# EAGLE design pinheader_breakout (EAGLE 7.4.0)
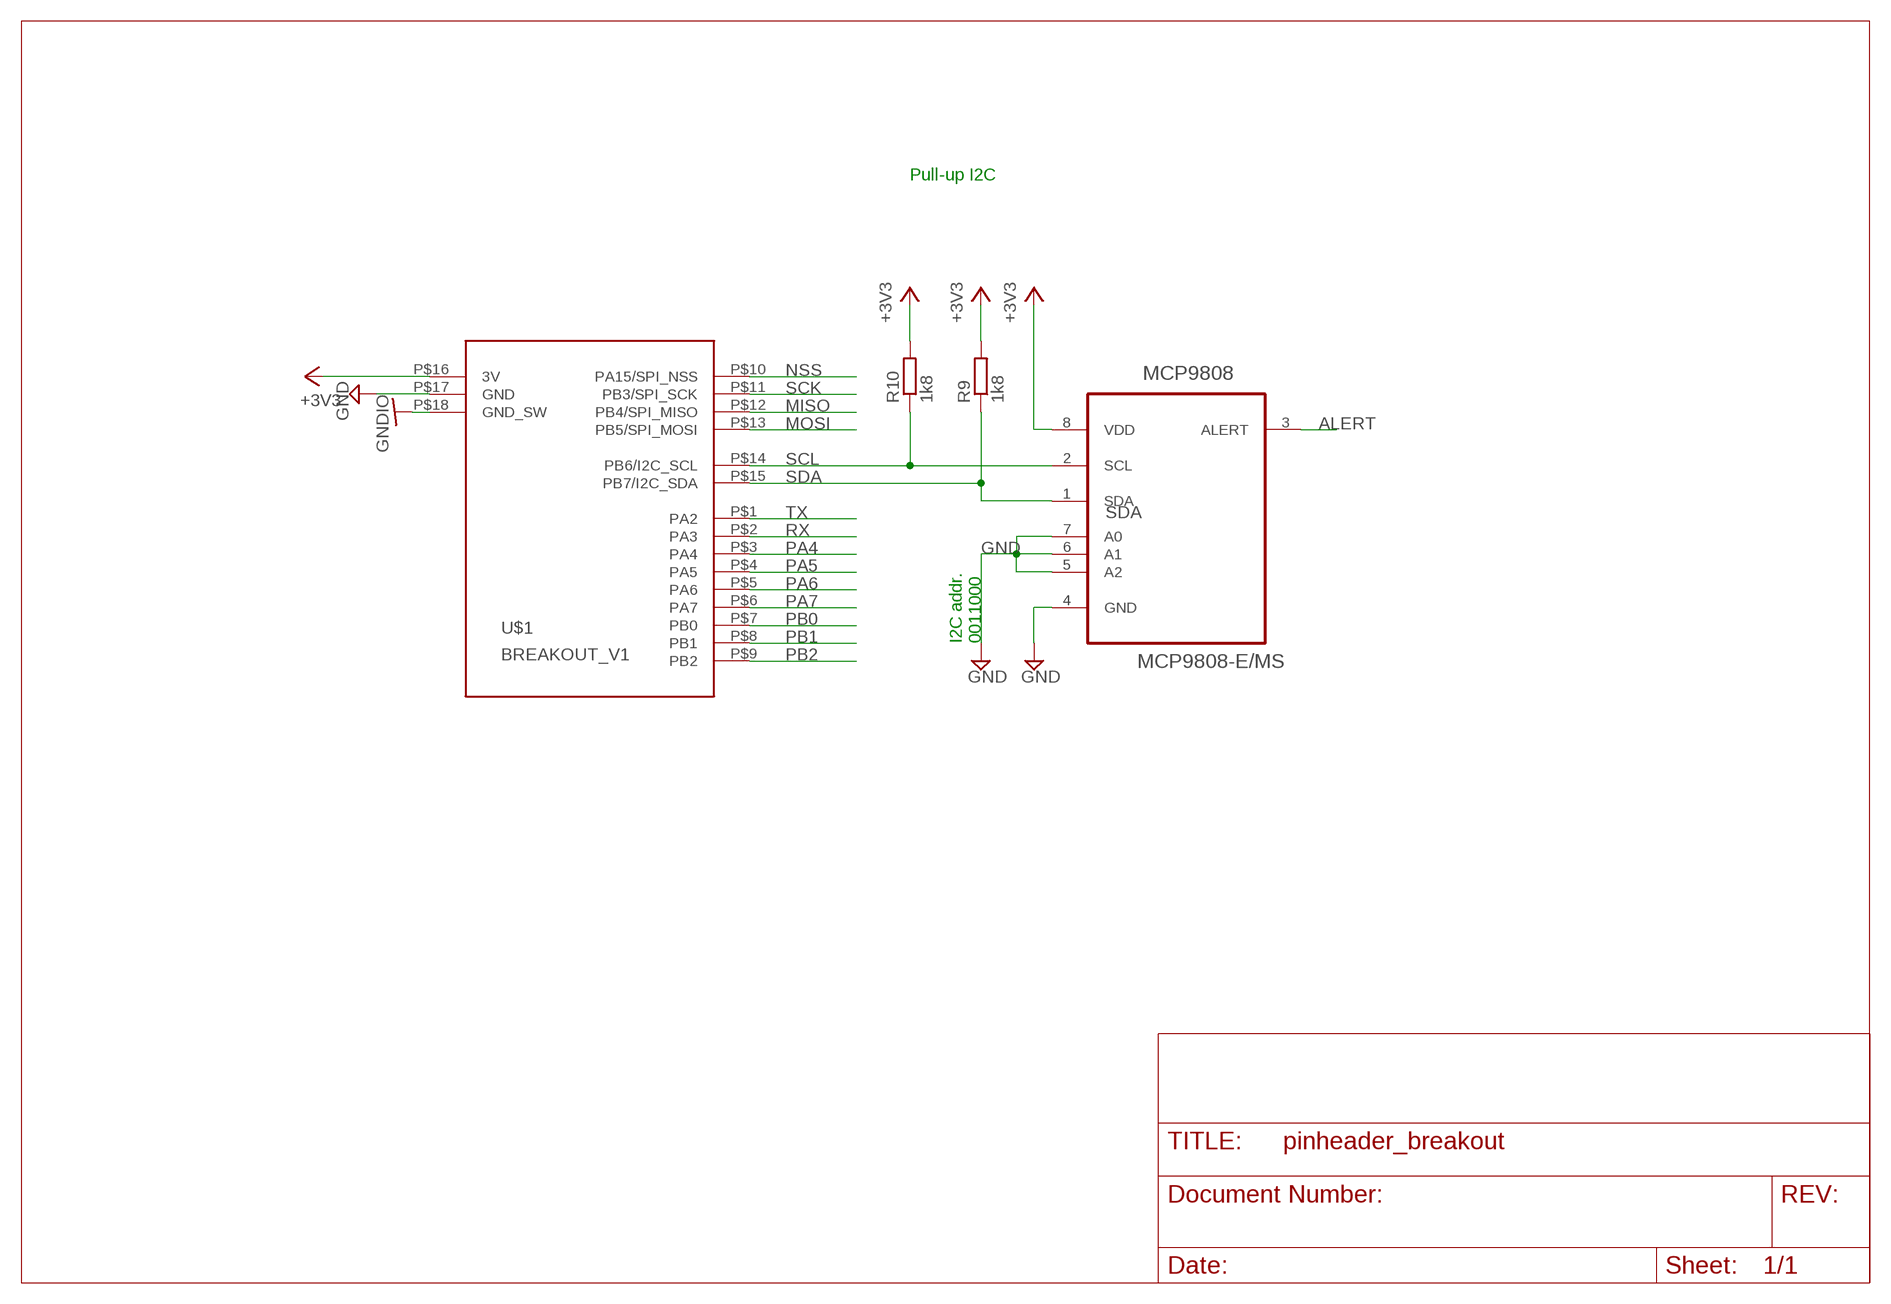
[diagram p0: schematic, sheet 1]

## Parts
MCP9808  MCP9808-E/MS  [SOP65P490X110-8N]
R9  1k8  R-EU_R0805  [R0805]
R10  1k8  R-EU_R0805  [R0805]
U$1  BREAKOUT_V1  [BREAKOUT_V1]

## Nets
+3V3: MCP9808.8(VDD) R9.2 R10.2 U$1.P$16(3V)
ALERT: MCP9808.3(ALERT)
GND: MCP9808.4(GND) MCP9808.5(A2) MCP9808.6(A1) MCP9808.7(A0) U$1.P$17(GND)
GNDIO: U$1.P$18(GND_SW)
MISO: U$1.P$12(PB4/SPI_MISO)
MOSI: U$1.P$13(PB5/SPI_MOSI)
NSS: U$1.P$10(PA15/SPI_NSS)
PA4: U$1.P$3(PA4)
PA5: U$1.P$4(PA5)
PA6: U$1.P$5(PA6)
PA7: U$1.P$6(PA7)
PB0: U$1.P$7(PB0)
PB1: U$1.P$8(PB1)
PB2: U$1.P$9(PB2)
RX: U$1.P$2(PA3)
SCK: U$1.P$11(PB3/SPI_SCK)
SCL: MCP9808.2(SCL) R10.1 U$1.P$14(PB6/I2C_SCL)
SDA: MCP9808.1(SDA) R9.1 U$1.P$15(PB7/I2C_SDA)
TX: U$1.P$1(PA2)

## Notes on the sheet
- Pull-up I2C
- I2C addr. 
  0011000

## Library data of the parts
MCP9808 = mcp9808:MCP9808-E/MS: Digital Temperature Sensor,MSOP-8; MPN: MCP9808-E/MS; OC_FARNELL: 2080523; OC_NEWARK: 89T8871; PACKAGE: MSOP-8; SUPPLIER: MICROCHIP
R9 R10 = rcl:R-EU_: RESISTOR, European symbol
U$1 = breakout_base:BREAKOUT_V1

## Board
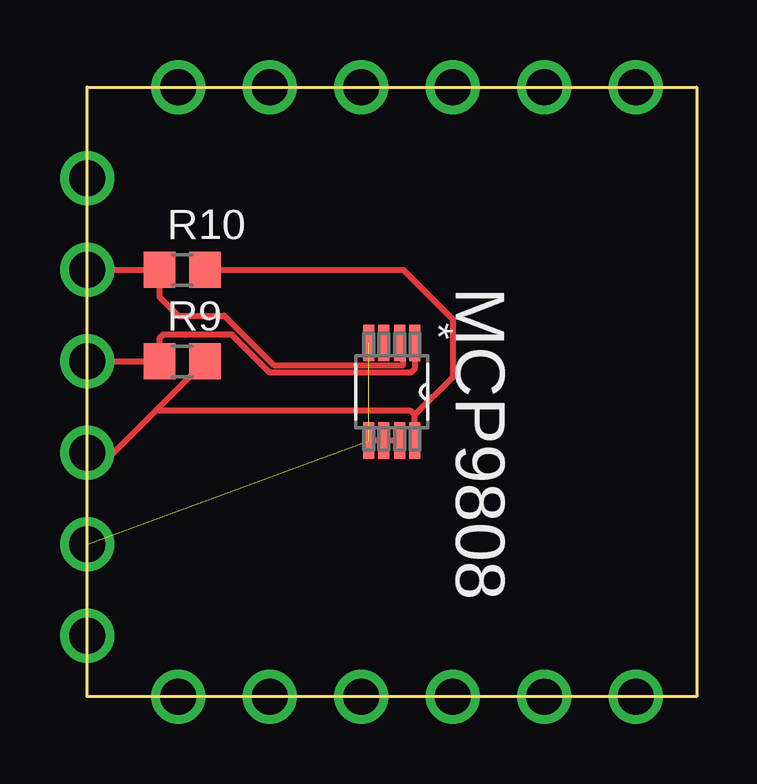
[diagram p1: board, top side]

Size 25.4 x 25.4 mm. Coordinates in mm from the lower left corner, seen from the top.
Outline: 0,0 25.4,0 25.4,25.4 0,25.39 0,0
Copper layers (1*16): Top 0.035mm / dielectric 1.5mm / Bottom 0.035mm
Design rules "default": minimum track width 10mil, minimum drill 24mil, track to track 8mil, track to pad 8mil, pad to pad 8mil, via to via 8mil, smd to smd 8mil, copper to edge 40mil, drill to drill 8mil, minimum pad ring 10mil, minimum via ring 8mil, stop-mask expansion 4mil, vias tented up to drill 0mil, thermal gap 10mil

### Footprints (pad centres in the part's own frame; a part is rotated, then mirrored left to right if it is on the bottom)
SOP65P490X110-8N = smd 1.524 x 0.457: 1 -2.032,0.965; 2 -2.032,0.33; 3 -2.032,-0.33; 4 -2.032,-0.965; 5 2.032,-0.965; 6 2.032,-0.33; 7 2.032,0.33; 8 2.032,0.965
R0805 = smd 1.3 x 1.5: 1 -0.95,0; 2 0.95,0
BREAKOUT_V1 = drill 1.5: P$1 3.81,0; P$2 7.62,0; P$3 11.43,0; P$4 15.24,0; P$5 19.05,0; P$6 22.86,0; P$7 22.86,25.4; P$8 19.05,25.4; P$9 15.24,25.4; P$10 11.43,25.4; P$11 7.62,25.4; P$12 3.81,25.4; P$13 0,21.59; P$14 0,17.78; P$15 0,13.97; P$16 0,10.16; P$17 0,6.35; P$18 0,2.54

### Placement (x,y rotation side)
MCP9808  12.7,12.7 270 top
R9  3.97,13.97 0 top
R10  3.97,17.78 0 top
U$1  0,0 0 top

### Tracks (layer width: path | path; a pad name or v marks a point on that pad's centre or on a via)
+3V3
  Top 0.254: U$1.P$16 1.11,10.16 2.85,11.91 | 2.85,11.91 R9.2 | MCP9808.8 13.66,11.73 | 13.66,11.73 13.49,11.91 2.85,11.91 | R10.2 13.18,17.78 15.24,15.72 15.24,13.31 13.66,11.73
GND  (2 unrouted)
  Top 0.254: MCP9808.7 MCP9808.6 MCP9808.5
SCL
  Top 0.254: U$1.P$14 R10.1 3.02,16.67 3.81,15.88 5.71,15.88 7.78,13.81 13.18,13.81 13.18,14.59 MCP9808.2
SDA
  Top 0.254: U$1.P$15 R9.1 | MCP9808.1 13.66,13.66 13.49,13.49 7.62,13.49 6.03,15.08 3.17,15.08 3.02,14.92 R9.1 | R9.1